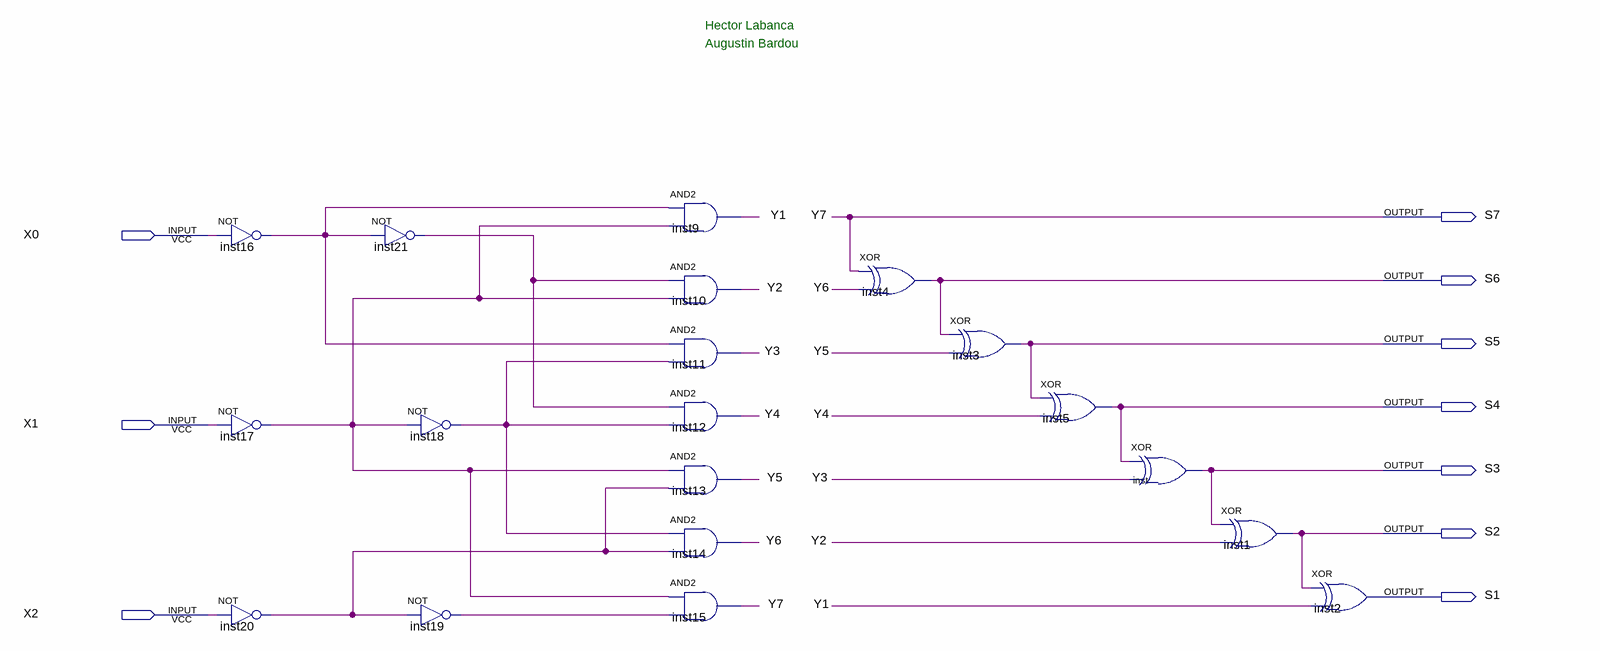
[diagram p0: schematic sheet]
// Quartus schematic exo1.bdf as structural Verilog: 19 symbols, 10 pins
module exo1 (
  input  X0,
  input  X1,
  input  X2,
  output S7,
  output S6,
  output S5,
  output S4,
  output S3,
  output S2,
  output S1
);

  wire inst16_out, inst17_out, inst18_out, inst19_out, inst20_out, inst21_out, Y1, Y2, Y3, Y4, Y5, Y6;

  not inst16 (inst16_out, X0);
  not inst17 (inst17_out, X1);
  not inst20 (inst20_out, X2);
  not inst21 (inst21_out, inst16_out);
  not inst18 (inst18_out, inst17_out);
  not inst19 (inst19_out, inst20_out);
  and inst9 (Y1, inst16_out, inst17_out);
  and inst10 (Y2, inst21_out, inst17_out);
  and inst11 (Y3, inst16_out, inst18_out);
  and inst12 (Y4, inst21_out, inst18_out);
  and inst13 (Y5, inst17_out, inst20_out);
  and inst14 (Y6, inst18_out, inst20_out);
  and inst15 (S7, inst17_out, inst19_out);
  xor inst4 (S6, S7, Y6);
  xor inst3 (S5, S6, Y5);
  xor inst5 (S4, S5, Y4);
  xor inst (S3, S4, Y3);
  xor inst1 (S2, S3, Y2);
  xor inst2 (S1, S2, Y1);

  // Other names for the same wires on the sheet: Y7 = S7

  // Notes on the sheet:
  //   Hector Labanca
  //   Augustin Bardou
endmodule
